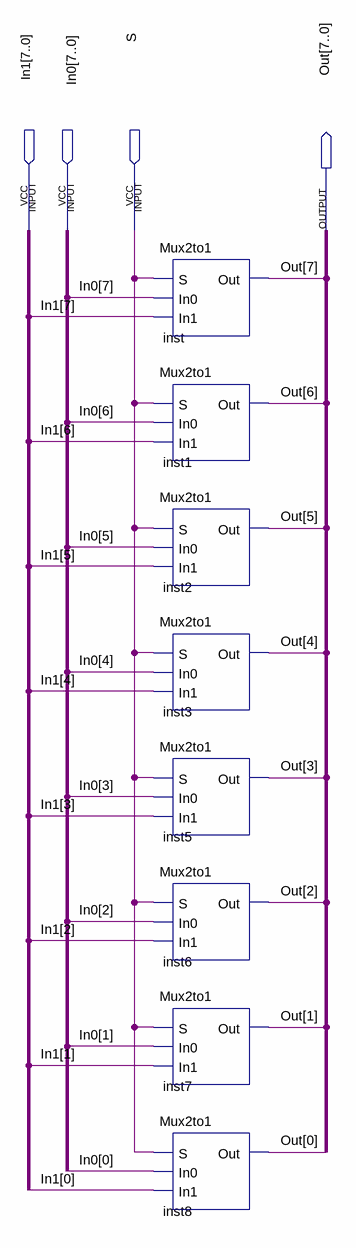
[diagram p0: schematic sheet]
// Quartus schematic Mux2to1_8bit.bdf as structural Verilog: 8 symbols, 4 pins
module Mux2to1_8bit (
  input  [7:0] In1,
  input  [7:0] In0,
  input  S,
  output [7:0] Out
);

  Mux2to1 inst (.S(S), .In0(In0[7]), .In1(In1[7]), .Out(Out[7]));
  Mux2to1 inst1 (.S(S), .In0(In0[6]), .In1(In1[6]), .Out(Out[6]));
  Mux2to1 inst2 (.S(S), .In0(In0[5]), .In1(In1[5]), .Out(Out[5]));
  Mux2to1 inst3 (.S(S), .In0(In0[4]), .In1(In1[4]), .Out(Out[4]));
  Mux2to1 inst5 (.S(S), .In0(In0[3]), .In1(In1[3]), .Out(Out[3]));
  Mux2to1 inst6 (.S(S), .In0(In0[2]), .In1(In1[2]), .Out(Out[2]));
  Mux2to1 inst7 (.S(S), .In0(In0[1]), .In1(In1[1]), .Out(Out[1]));
  Mux2to1 inst8 (.S(S), .In0(In0[0]), .In1(In1[0]), .Out(Out[0]));
endmodule
